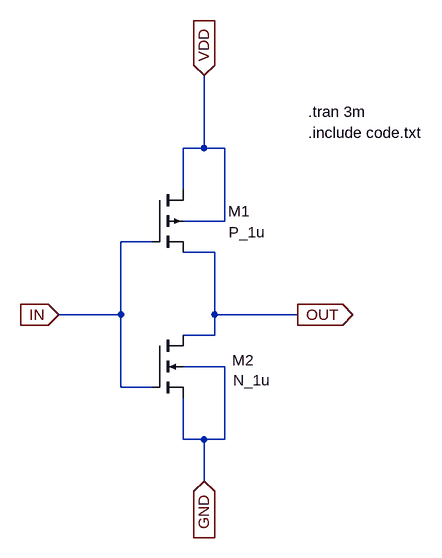
[diagram p0: schematic Circuit2_Part1_inverterUsingMosfets.asc]
Circuit2_Part1_inverterUsingMosfets.asc, the LTspice schematic file:
Version 4
SHEET 1 880 680
WIRE -32 -80 -32 -192
WIRE -32 -80 -64 -80
WIRE 0 -80 -32 -80
WIRE -64 -16 -64 -80
WIRE 0 32 0 -80
WIRE 0 32 -64 32
WIRE -112 64 -160 64
WIRE -16 80 -64 80
WIRE -160 176 -160 64
WIRE -160 176 -256 176
WIRE -16 176 -16 80
WIRE 112 176 -16 176
WIRE -16 208 -16 176
WIRE -16 208 -64 208
WIRE 0 256 -64 256
WIRE -160 288 -160 176
WIRE -112 288 -160 288
WIRE -64 368 -64 304
WIRE -32 368 -64 368
WIRE 0 368 0 256
WIRE 0 368 -32 368
WIRE -32 432 -32 368
FLAG -256 176 IN
IOPIN -256 176 In
FLAG 112 176 OUT
IOPIN 112 176 Out
FLAG -32 -192 VDD
IOPIN -32 -192 In
FLAG -32 432 GND
IOPIN -32 432 In
SYMBOL pmos4 -112 -16 R0
WINDOW 0 117 33 Left 2
WINDOW 3 118 65 Left 2
SYMATTR InstName M1
SYMATTR Value P_1u
SYMATTR Value2 l=1u w=10u
SYMBOL nmos4 -112 208 R0
WINDOW 0 123 38 Left 2
WINDOW 3 125 69 Left 2
SYMATTR InstName M2
SYMATTR Value N_1u
SYMATTR Value2 l=1u w=10u
TEXT 128 -136 Left 2 !.tran 3m
TEXT 128 -104 Left 2 !.include code.txt

The netlist it stands for:
* Circuit2_Part1_inverterUsingMosfets.asc
M1 VDD IN OUT VDD P_1u l=1u w=10u
M2 OUT IN GND GND N_1u l=1u w=10u
.model NMOS NMOS
.model PMOS PMOS
.lib standard.mos
.tran 3m
.include code.txt
.backanno
.end